# EAGLE design BRD161001 (EAGLE 7.6.0)
REV: R020x; TITLE: Slave clock pulse driver
Assembly variants: R02.0x
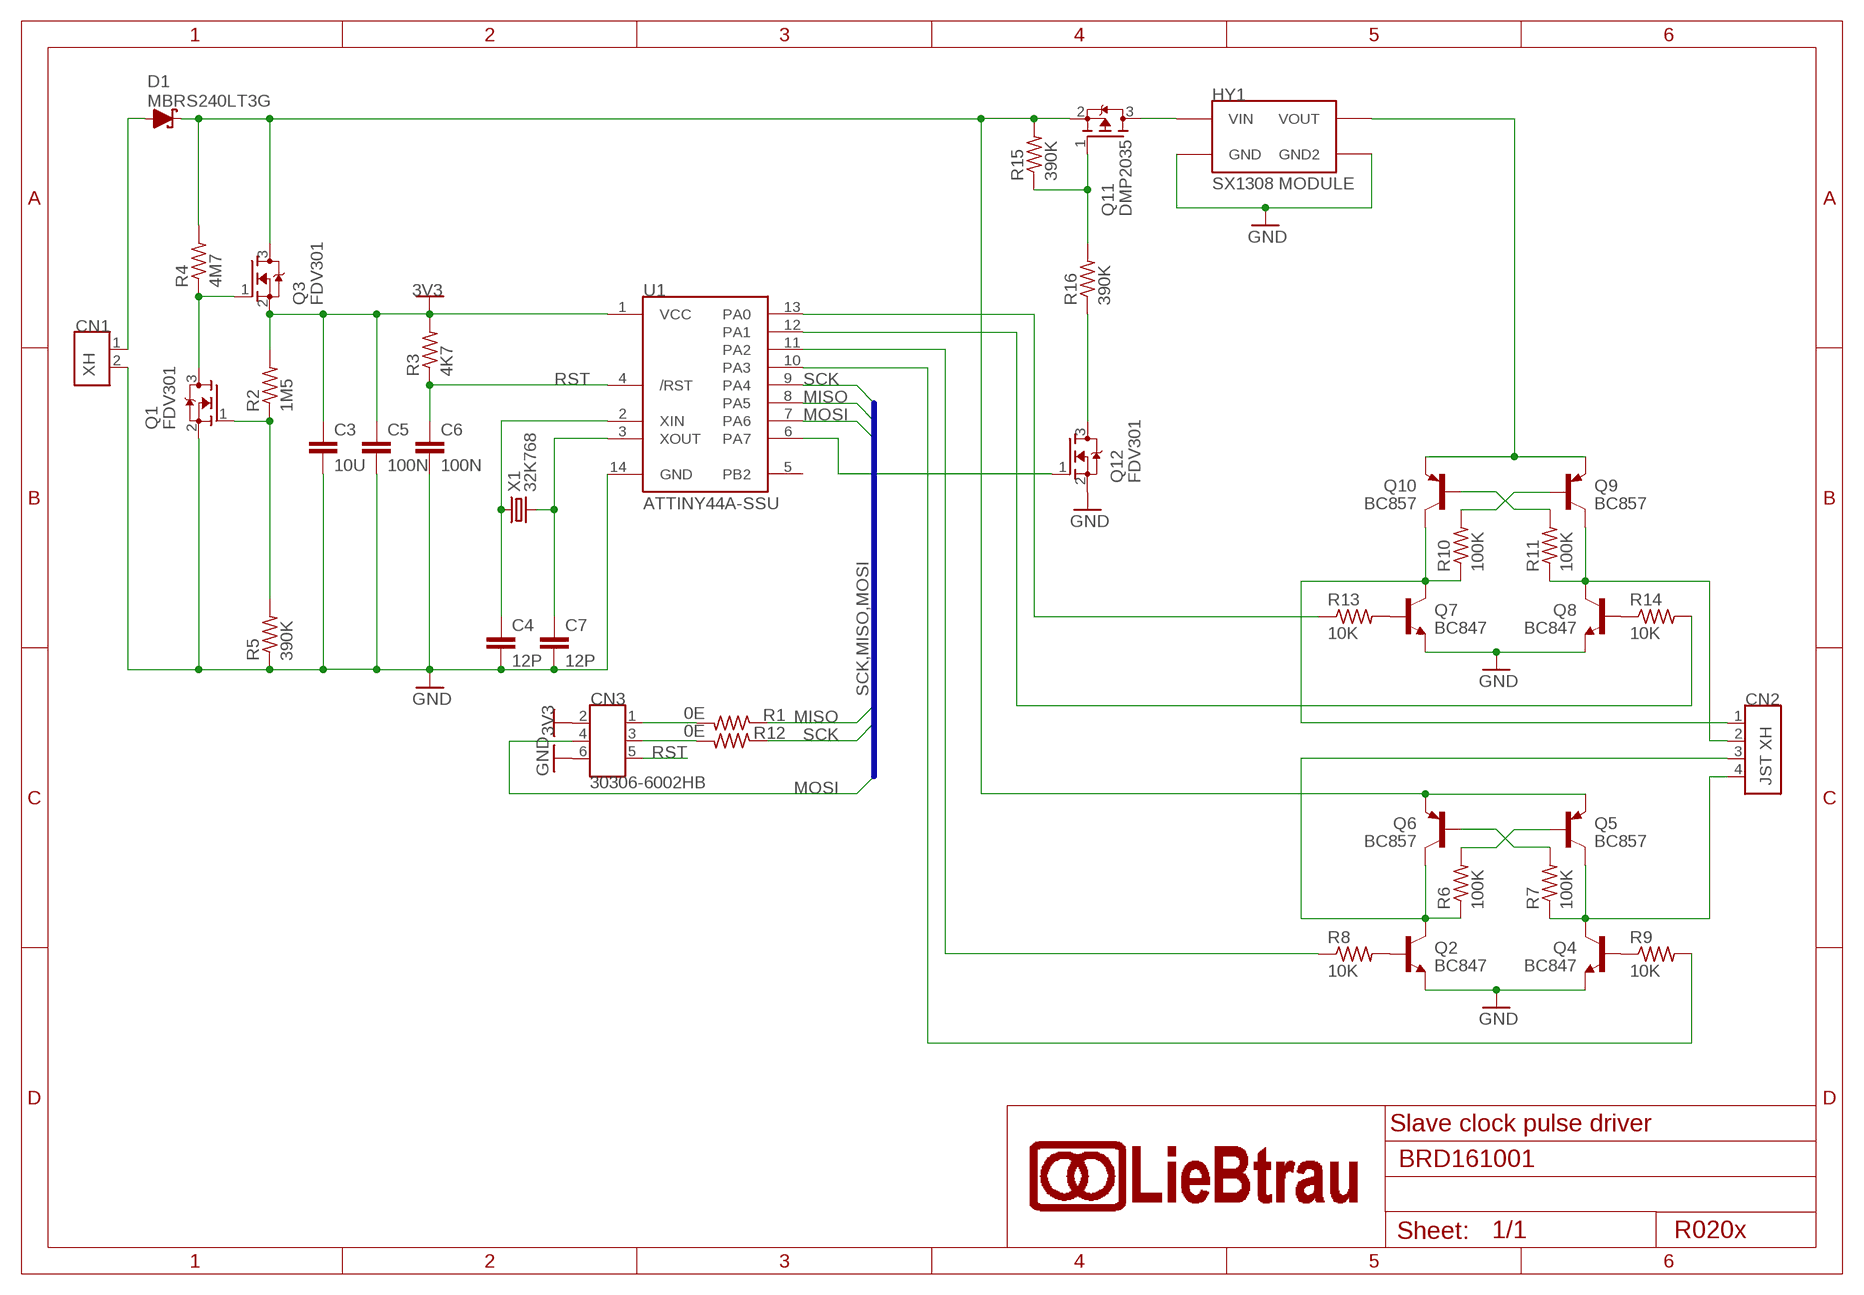
[diagram p0: schematic, sheet 1]

## Parts
C3  10U  CA_10U_1206  [CA_1206]
C4  12P  CA_12P_0603  [CA_0603]
C5  100N  CA_100N_1206  [CA_1206]
C6  100N  CA_100N_1206  [CA_1206]
C7  12P  CA_12P_0603  [CA_0603]
CN1  XH  CN_2P_JST_B2B-XH_JST_B2B-XH  [CN_HDR1X2_180D_P25_JST_B2B-XH]
CN2  JST XH  CN_4P_JST_B4B-XH_JST_B4B-XH  [CN_HDR1X4_180D_P25_JST_B4B-XH]
CN3  30306-6002HB  CN_2X3P_IDC6_180D_P25_3M  [CN_HDR2X3_180D_P25_3M]
D1  MBRS240LT3G  DI_SCHOTTKY_MBRS240_DO-214AA  [DI_DO214AA_SMB]
HY1  SX1308 MODULE  HY_SX1308_SX1308_SX1308  [HY_SX1308]
Q1  FDV301  TR_NMOS_FDV301_SOT23  [SC_SOT23]
Q2  BC847  TR_NPN_BC847_SOT23  [SC_SOT23]
Q3  FDV301  TR_NMOS_FDV301_SOT23  [SC_SOT23]
Q4  BC847  TR_NPN_BC847_SOT23  [SC_SOT23]
Q5  BC857  TR_PNP_BC857_SOT23  [SC_SOT23]
Q6  BC857  TR_PNP_BC857_SOT23  [SC_SOT23]
Q7  BC847  TR_NPN_BC847_SOT23  [SC_SOT23]
Q8  BC847  TR_NPN_BC847_SOT23  [SC_SOT23]
Q9  BC857  TR_PNP_BC857_SOT23  [SC_SOT23]
Q10  BC857  TR_PNP_BC857_SOT23  [SC_SOT23]
Q11  DMP2035  TR_PMOS_DMP2035_SOT23  [SC_SOT23]
Q12  FDV301  TR_NMOS_FDV301_SOT23  [SC_SOT23]
R1  0E  RE_0E_1206  [RE_1206]
R2  1M5  RE_1M5_1206  [RE_1206]
R3  4K7  RE_4K7_1206  [RE_1206]
R4  4M7  RE_4M7_1206  [RE_1206]
R5  390K  RE_390K_1206  [RE_1206]
R6  100K  RE_100K_1206  [RE_1206]
R7  100K  RE_100K_1206  [RE_1206]
R8  10K  RE_10K_1206  [RE_1206]
R9  10K  RE_10K_1206  [RE_1206]
R10  100K  RE_100K_1206  [RE_1206]
R11  100K  RE_100K_1206  [RE_1206]
R12  0E  RE_0E_1206  [RE_1206]
R13  10K  RE_10K_1206  [RE_1206]
R14  10K  RE_10K_1206  [RE_1206]
R15  390K  RE_390K_1206  [RE_1206]
R16  390K  RE_390K_1206  [RE_1206]
U1  ATTINY44A-SSU  IC_ATTINY44_ATTINY44A_SSU  [SC_SO14]
X1  32K768  XT_32K768_3215_32K768_3215  [XT_3215]

## Nets
3V3: C3.1 C5.1 CN3.2 Q3.2(S) R2.2 R3.2 U1.1(VCC)
GND: C3.2 C4.2 C5.2 C6.2 C7.2 CN1.2 CN3.6 HY1.GND1(GND) HY1.GND2 Q1.2(S) Q2.2(E) Q4.2(E) Q7.2(E) Q8.2(E) Q12.2(S) R5.1 U1.14(GND)
MISO: R1.1 U1.8(PA5)
MOSI: CN3.4 U1.7(PA6)
N$1: CN1.1 D1.A
N$2: D1.C Q3.3(D) Q5.2(E) Q6.2(E) Q11.2(S) R4.2 R15.2
N$3: Q5.1(B) R6.2
N$4: Q1.3(D) Q3.1(G) R4.1
N$5: Q6.1(B) R7.2
N$6: Q1.1(G) R2.1 R5.2
N$7: C4.1 U1.2(XIN) X1.1
N$8: CN2.4 Q4.3(C) Q5.3(C) R7.1
N$9: C7.1 U1.3(XOUT) X1.2
N$10: CN2.3 Q2.3(C) Q6.3(C) R6.1
N$11: Q2.1(B) R8.2
N$12: Q4.1(B) R9.1
N$13: HY1.OUT(VOUT) Q9.2(E) Q10.2(E)
N$14: R9.2 U1.10(PA3)
N$15: R8.1 U1.11(PA2)
N$16: Q9.1(B) R10.2
N$17: Q10.1(B) R11.2
N$18: Q7.1(B) R13.2
N$19: Q8.1(B) R14.1
N$20: R14.2 U1.12(PA1)
N$21: Q11.1(G) R15.1 R16.2
N$22: CN2.2 Q8.3(C) Q9.3(C) R11.1
N$23: CN2.1 Q7.3(C) Q10.3(C) R10.1
N$24: CN3.1 R1.2
N$25: CN3.3 R12.2
N$26: R13.1 U1.13(PA0)
N$27: Q12.1(G) U1.6(PA7)
N$28: Q12.3(D) R16.1
N$29: HY1.VIN Q11.3(D)
RST: C6.1 CN3.5 R3.1 U1.4(/RST)
SCK: R12.1 U1.9(PA4)
Unconnected: U1.5(PB2)

## Buses
SCK,MISO,MOSI

## Library data of the parts
C3 = lieBtrau:CA; COST: 0.27; ORDERCODE: 1276-6767-1-ND
C4 C7 = lieBtrau:CA; COST: 0.09; ORDERCODE: 1276-1254-1-ND
C5 C6 = lieBtrau:CA; COST: 0.09; ORDERCODE: 399-1249-1-ND
CN1 = lieBtrau:CN_2P; COST: 0.13; ORDERCODE: 455-2247-ND
CN2 = lieBtrau:CN_4P; COST: 0.19; ORDERCODE: 455-2249-ND
CN3 = lieBtrau:CN_2X3P; COST: 0.58; ORDERCODE: 3M15451-ND
D1 = lieBtrau:DI_SCHOTTKY; COST: 0.39; ORDERCODE: MBRS240LT3GOSCT-ND
HY1 = lieBtrau:HY_SX1308: SX1308 Module: AliXpress cheap module <https://www.aliexpress.com/item/DC-DC-SX1308-Step-UP-Adjustable-Power-Module-Boost-Converter/32642837831.html?spm=2114.01010208.3.140.kQ55jh&ws_ab_test=searchweb0_0,searchweb201602_2_10091_10090_10088_10089,searchweb201603_1&btsid=6096abb5-f3e5-4d5b-8a4f-20ab252ccc27> AliXpress good pix module <https://www.aliexpress.com/item-img/10pcs-lot-Free-shipping-High-Current-2A-DC-DC-SX1308-adjustable-boost-module/32518786494.html?spm=2114.10010108.1000017.2.6KsUWM#> Original module: Shenzen LC Technology Co.,Ltd. <http://www.chinalctech.com/index.php?_m=mod_product&_a=view&p_id=1046>; COST: 0.69; ORDERCODE: AliExpress
Q1 Q3 Q12 = lieBtrau:TR_NMOS; COST: 0.21; ORDERCODE: FDV301NCT-ND
Q2 Q4 Q7 Q8 = lieBtrau:TR_NPN; COST: 0.12; ORDERCODE: 568-1636-1-ND
Q5 Q6 Q9 Q10 = lieBtrau:TR_PNP; COST: 0.38; ORDERCODE: BC857BLT1GOSCT-ND
Q11 = lieBtrau:TR_PMOS; COST: 0.38; ORDERCODE: DMP2035U-7DICT-ND
R1 R12 = lieBtrau:RE; COST: 0.09; ORDERCODE: 311-0.0ERCT-ND
R2 = lieBtrau:RE; COST: 0.09; ORDERCODE: P1.50MFCT-ND
R3 = lieBtrau:RE; COST: 0.09; ORDERCODE: RMCF1206FT4K70CT-ND
R4 = lieBtrau:RE; COST: 0.09; ORDERCODE: 311-4.70MFRCT-ND
R5 R15 R16 = lieBtrau:RE; COST: 0.09; ORDERCODE: 311-390KFRCT-ND
R6 R7 R10 R11 = lieBtrau:RE; COST: 0.09; ORDERCODE: 311-100KFRCT-ND
R8 R9 R13 R14 = lieBtrau:RE; COST: 0.09; ORDERCODE: 311-10.0KFRCT-ND
U1 = lieBtrau:IC_ATTINY44; COST: 1.28; ORDERCODE: ATTINY44A-SSU-ND
X1 = lieBtrau:XT_32K768_3215; COST: 0.67; ORDERCODE: 535-13352-1-ND

## Board
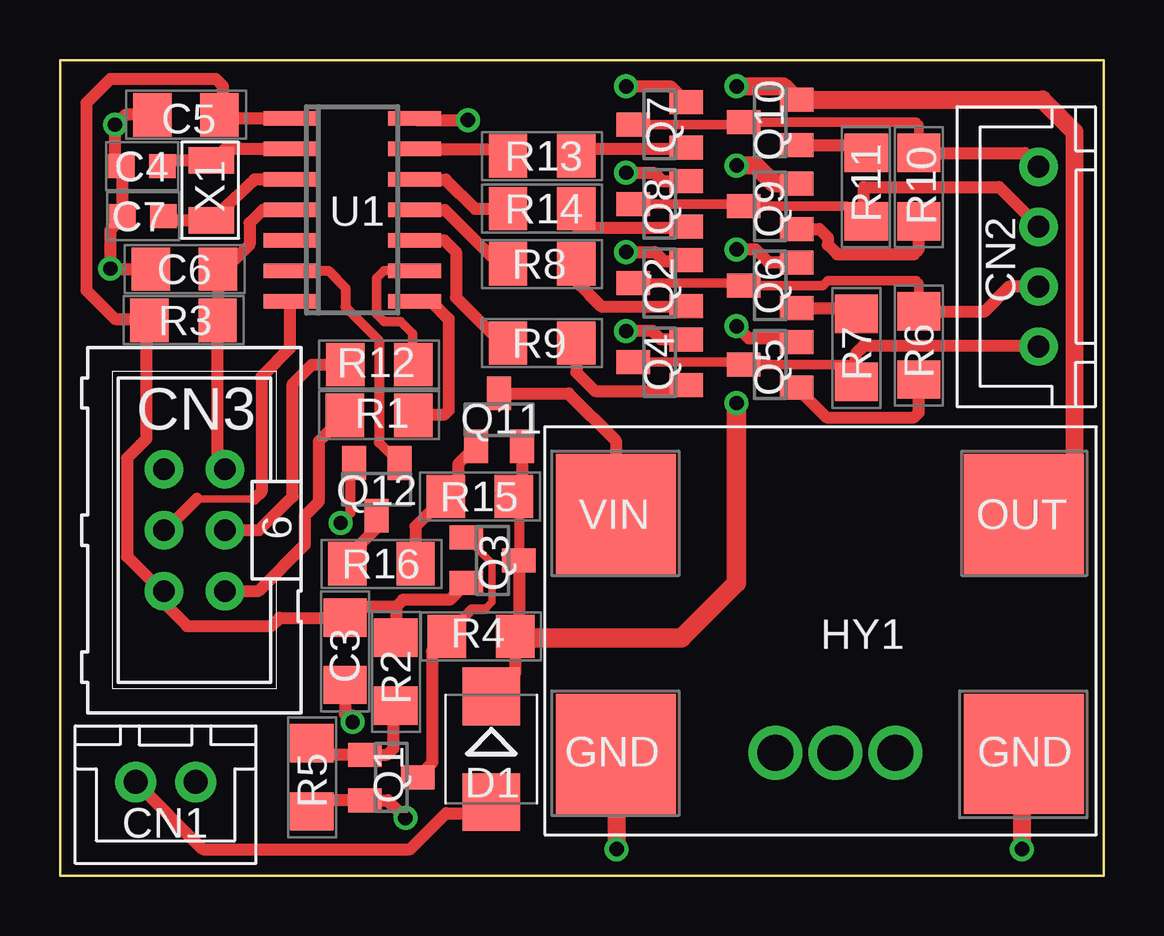
[diagram p1: board, top side]
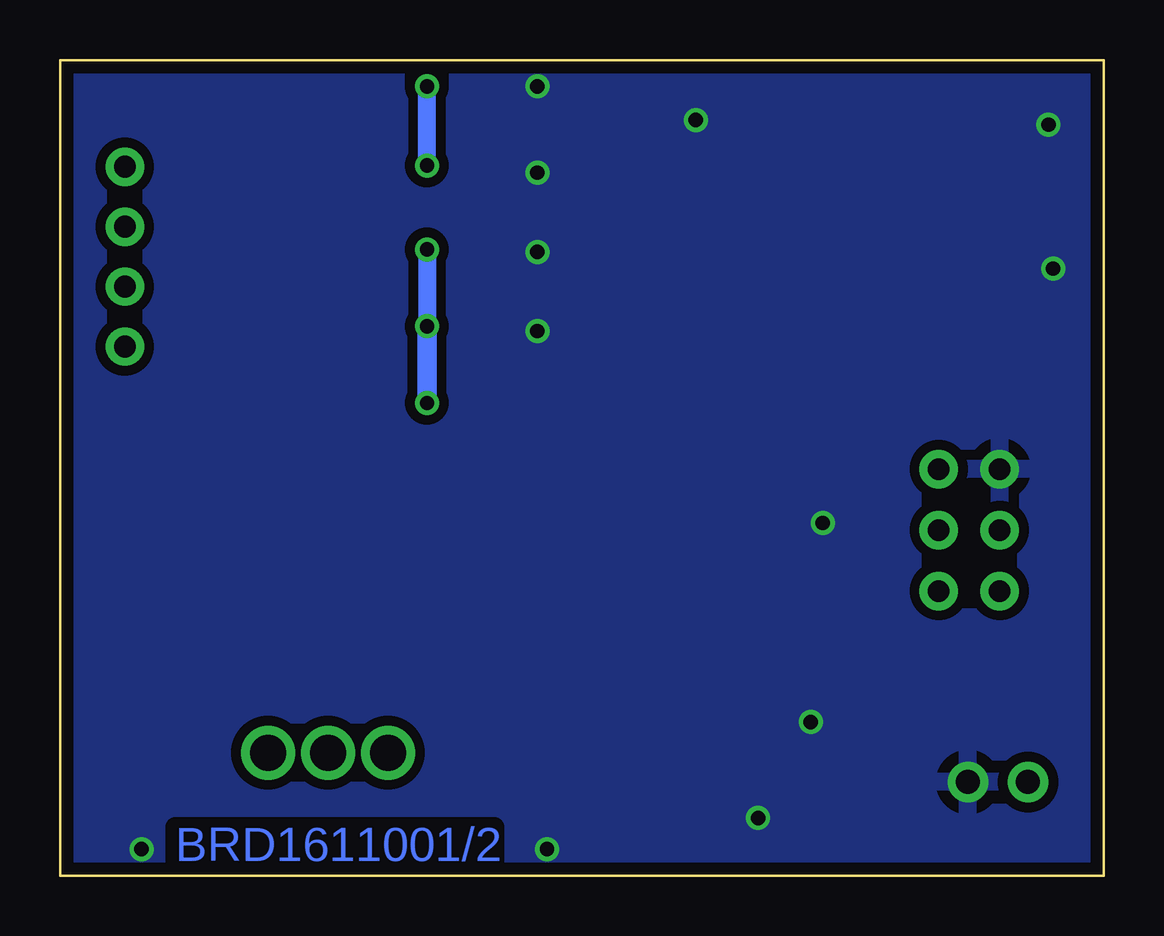
[diagram p2: board, bottom side, seen from below]

Size 43.5 x 34 mm. Coordinates in mm from the lower left corner, seen from the top.
Outline: 0,0 43.5,0 43.5,34 0,34 0,0
Copper layers (1*16): Top 0.035mm / dielectric 1.5mm / Bottom 0.035mm
Design rules "dtron": minimum track width 0.175mm, minimum drill 0.6mm, track to track 0.25mm, track to pad 0.25mm, pad to pad 0.2mm, via to via 0.25mm, smd to smd 0.2mm, copper to edge 0.5mm, drill to drill 0.2mm, minimum pad ring 0.25mm, minimum via ring 0.2mm, stop-mask expansion 0.1mm, vias tented up to drill 0mil, thermal gap 0.5mm

### Footprints (pad centres in the part's own frame; a part is rotated, then mirrored left to right if it is on the bottom)
CA_1206 = smd 1.6 x 1.8: 1 -1.4,0; 2 1.4,0
CA_0603 = smd 1.1 x 1: 1 -0.85,0; 2 0.85,0
CN_HDR1X2_180D_P25_JST_B2B-XH = drill 1 pad 1.7: 1 -1.25,0; 2 1.25,0
CN_HDR1X4_180D_P25_JST_B4B-XH = drill 0.9 pad 1.6: 1 -3.75,0; 2 -1.25,0; 3 1.25,0; 4 3.75,0
CN_HDR2X3_180D_P25_3M = drill 0.9 pad 1.6: 1 -2.54,-1.27; 2 -2.54,1.27; 3 0,-1.27; 4 0,1.27; 5 2.54,-1.27; 6 2.54,1.27
DI_DO214AA_SMB = smd 2.4 x 2.4: A 2.2,0; C -2.2,0
HY_SX1308 = smd 5 x 5: GND1 -8.47,5.12; GND2 8.53,5.12; OUT -8.47,-4.88; VIN 8.53,-4.88 | drill 1.5: P$1 -3.13,5.08; P$2 -0.63,5.08; P$3 1.87,5.08
SC_SOT23 = smd 1 x 1.4: 1 -0.95,-1.1; 2 0.95,-1.1; 3 0,1.1
RE_1206 = smd 1.6 x 1.803: 1 -1.422,0; 2 1.422,0
SC_SO14 = smd 0.6 x 2.2: 1 -3.81,-2.6; 2 -2.54,-2.6; 3 -1.27,-2.6; 4 0,-2.6; 5 1.27,-2.6; 6 2.54,-2.6; 7 3.81,-2.6; 8 3.81,2.6; 9 2.54,2.6; 10 1.27,2.6; 11 0,2.6; 12 -1.27,2.6; 13 -2.54,2.6; 14 -3.81,2.6
XT_3215 = smd 1.1 x 1.9: 1 -1.25,0; 2 1.25,0

### Placement (x,y rotation side)
C3  11.88,9.35 270 top
C4  3.42,29.58 180 top
C5  5.25,31.71 180 top
C6  5.19,25.28 180 top
C7  3.46,27.49 180 top
CN1  4.4,3.9 0 top
CN2  40.8,25.8 270 top
CN3  5.6,14.4 90 top
D1  17.98,5.27 270 top
HY1  31.7,10.2 180 top
Q1  13.81,4.09 270 top
Q2  25,24.7 90 top
Q3  18.03,13.14 270 top
Q4  25,21.4 90 top
Q5  29.6,21.3 90 top
Q6  29.6,24.6 90 top
Q7  25,31.3 90 top
Q8  25,28 90 top
Q9  29.6,27.9 90 top
Q10  29.6,31.4 90 top
Q11  18.3,19 0 top
Q12  13.2,16.1 180 top
R1  13.3,19.19 180 top
R2  14,8.5 90 top
R3  5.15,23.15 180 top
R4  17.55,9.97 0 top
R5  10.5,4.1 90 top
R6  35.8,22.1 270 top
R7  33.2,22 90 top
R8  20.1,25.5 0 top
R9  20.1,22.2 180 top
R10  35.8,28.7 270 top
R11  33.6,28.7 90 top
R12  13.31,21.3 180 top
R13  20.1,30 0 top
R14  20.1,27.8 180 top
R15  17.5,15.8 0 top
R16  13.4,13 0 top
U1  12.18,27.75 270 top
U$2  [FR_FRAME_A5]  -72.4,-59.9 0 top  (outside the outline)
X1  6.31,28.57 270 top

### Tracks (layer width: path | path; a pad name or v marks a point on that pad's centre or on a via)
3V3
  Top 0.305: CN3.2 4.25,11.85
  Top 0.5: U1.1 6.8,31.56 | 6.8,31.56 C5.1 | 4.25,11.85 2.8,13.3 2.8,17.4 3.6,18.2 3.6,23.02 | 6.8,31.56 6.8,32.9 6.5,33.2 2.1,33.2 1.1,32.2 1.1,24.4 2.3,23.2 3.68,23.2 arc-90 R3.2 | Q3.2 16.24,11.5 14.3,11.5 14,11.2 | 14,11.2 R2.2 | 14,11.2 12.33,11.2 C3.1 9.15,10.75 8.8,10.4 5.3,10.4 4.32,11.38 CN3.2
  Top 0.75: 3.6,23.02 R3.2
GND  (via drill 0.6)
  Top 0.406: Q12.2 12.1,17.25 12.1,15.1 v11.7,14.7
  Top 0.5: Q2.2 26.1,25.6 25.2,25.6 24.8,26 v23.6,26 | v23.6,22.7 24.7,22.7 25.05,22.35 Q4.2 | v23.6,32.9 25.45,32.9 Q7.2 | Q8.2 25.1,28.95 24.75,29.3 v23.6,29.3 | C5.2 2.71,31.71 v2.3,31.3 2.3,29.95 C4.2 2.6,29.55 C7.2 | 2.67,27.55 C7.2 | C7.2 2.6,27.4 2.1,26.9 v2.1,25.3 2.52,25.28 C6.2 | U1.14 14.84,31.5 v17,31.5 | 10.96,2.44 R5.1 10.96,3.14 Q1.2 13.66,3.14 v14.4,2.4 | C3.2 11.88,6.72 v12.2,6.4 | HY1.GND1 40.1,5.01 | HY1.GND2 23.2,5.05
  Top 0.75: 40.1,5.01 v40.1,1.1 | 23.2,5.05 v23.2,1.1
  pour Bottom (isolate 0.406): -4.75,36.5 -4.75,0 57.75,0.2 57.75,36.7
MISO
  Top 0.5: R1.1 14.73,19.2 16,19.2 16.2,19.4 16.2,23.2 15.5,23.9 14.82,23.9 U1.8
MOSI
  Top 0.305: 5.7,15.7 8.1,15.7 | 4.39,14.39 4.38,14.4 CN3.4
  Top 0.5: 4.39,14.39 5.7,15.7 | U1.7 9.58,21.98 8.4,20.8 8.4,16 8.1,15.7
N$1
  Top 0.5: D1.A 17.98,2.98 17.6,2.6 16.1,2.6 14.6,1.1 5.95,1.1 CN1.1
N$2  (via drill 0.6)
  Top 0.406: 19.13,15.59 Q3.3
  Top 0.5: Q6.2 29.55,25.55 29,26.1 v28.2,26.1 | v28.2,22.9 28.7,22.4 30.8,22.4 30.65,22.25 Q5.2 | Q11.2 19.25,16.13 arc-90 R15.2 19.13,15.59 | Q3.3 19.13,10.23 R4.2 18.97,8.46 D1.C
  Top 0.813: v28.2,19.7 28.2,12.2 25.9,9.9 19,9.9 19,9.94 R4.2
  Bottom 0.75: v28.2,26.1 v28.2,22.9
  Bottom 0.813: v28.2,19.7 v28.2,22.9
N$3
  Top 0.5: Q5.1 31.95,19.1 35.6,19.1 35.8,19.3 R6.2
N$4
  Top 0.305: Q3.1 18,13.02 18,11.4 17.7,11.1
  Top 0.406: 17.7,11.1 17.16,11.1 R4.1
  Top 0.5: R4.1 15.5,9.34 15.5,4.68 Q1.3
N$5
  Top 0.5: Q6.1 32.97,23.65 R7.2
N$6
  Top 0.5: R2.1 13.9,6.98 13.9,5.3 13.64,5.04 Q1.1 10.72,5.04 R5.2
N$7
  Top 0.5: C4.1 4.61,29.82 X1.1 6.88,30.29 U1.2
N$8
  Top 0.4: Q4.3 28.4,21.4 arc-90 Q5.3 33.18,21.3 arc90 R7.1
  Top 0.5: 33.18,21.3 33.18,21.78 33.5,22.1 40.75,22.1 CN2.4
N$9
  Top 0.5: U1.3 8.11,29.02 X1.2 4.48,27.32 C7.1
N$10
  Top 0.4: Q2.3 28.4,24.7 | Q6.3 31.8,24.6 32,24.8 35.7,24.8 35.8,24.7 R6.1
  Top 0.5: 28.4,24.7 Q6.3 | R6.1 35.82,23.5 38.5,23.5 39.55,24.55 CN2.3
N$11
  Top 0.5: Q2.1 26.05,23.7 22.6,23.7 21.52,24.78 R8.2
N$12
  Top 0.5: R9.1 21.52,20.98 22.3,20.2 25.85,20.2 arc90 Q4.1
N$13  (via drill 0.6)
  Top 0.75: HY1.OUT 41.6,15.08 41.6,15.1 42.3,15.8 42.3,31 40.95,32.35 Q10.2 30.15,32.9 v28.2,32.9 | Q9.2 29.75,28.85 29,29.6 v28.2,29.6
  Bottom 0.75: v28.2,29.6 v28.2,32.9
N$14
  Top 0.5: U1.10 16.02,26.48 16.5,26 16.5,24.1 18.4,22.2 R9.2
N$15
  Top 0.5: U1.11 16.05,27.75 18.3,25.5 R8.1
N$16
  Top 0.5: Q9.1 31.65,26.95 32,26.6 32,26.3 32.4,25.9 35.6,25.9 35.8,26.1 R10.2
N$17
  Top 0.5: 33.17,29.65 R11.2 33.27,30.45 Q10.1
N$18
  Top 0.5: R13.2 21.57,30.35 21.62,30.3 26.05,30.3 Q7.1
N$19
  Top 0.5: Q8.1 26.1,27 21.6,27 21.55,27.05 21.57,27.05 R14.1
N$20
  Top 0.5: U1.12 16.08,29.02 17.3,27.8 R14.2
N$21
  Top 0.5: Q11.1 16.6,17.15 16.6,15.9 16.5,15.8 R15.1 14.82,14.54 R16.2
N$22
  Top 0.4: Q8.3 28.4,28 arc-90 Q9.3 32.8,27.9 32.88,27.82 33.06,27.82 R11.1
  Top 0.5: R11.1 33.5,27.7 33.5,28.7 39.15,28.7 CN2.2
N$23
  Top 0.4: Q7.3 28.4,31.3 | Q10.3 35.7,31.4 35.8,31.3 R10.1
  Top 0.5: 28.4,31.3 Q10.3 | R10.1 40.23,30.12 CN2.1
N$24
  Top 0.5: R1.2 10.8,18.11 10.8,15.6 10.2,15 10.2,13.8 8.25,11.85 CN3.1
N$25
  Top 0.5: R12.2 10.5,21.3 9.7,20.5 9.7,15.8 8.29,14.39 CN3.3
N$26
  Top 0.5: U1.13 18.39,30.29 R13.1
N$27
  Top 0.406: U1.6 11.19,25.21 11.9,24.5 11.9,23.7 13.3,22.3 13.3,18.05 Q12.1
N$28
  Top 0.5: Q12.3 13.2,14.5 12.3,13.6 12.3,13.32 R16.1
N$29
  Top 0.5: HY1.VIN 23.17,18.13 21.2,20.1 Q11.3
RST
  Top 0.5: U1.4 8.45,27.75 7.9,27.2 7.9,26.3 7.26,25.66 6.97,25.66 C6.1 6.59,23.17 R3.1 | R3.1 6.86,22.86 | CN3.5 6.57,17.24 R3.1
SCK
  Top 0.4: U1.9 13.51,25.21 13.2,24.9 13.2,23.4 13.5,23.1 14.2,23.1 14.7,22.6 14.7,21.53 R12.1

### Text on the board
Bottom: BRD1611001/2